# Altium project Horror_esp32.PrjPcb
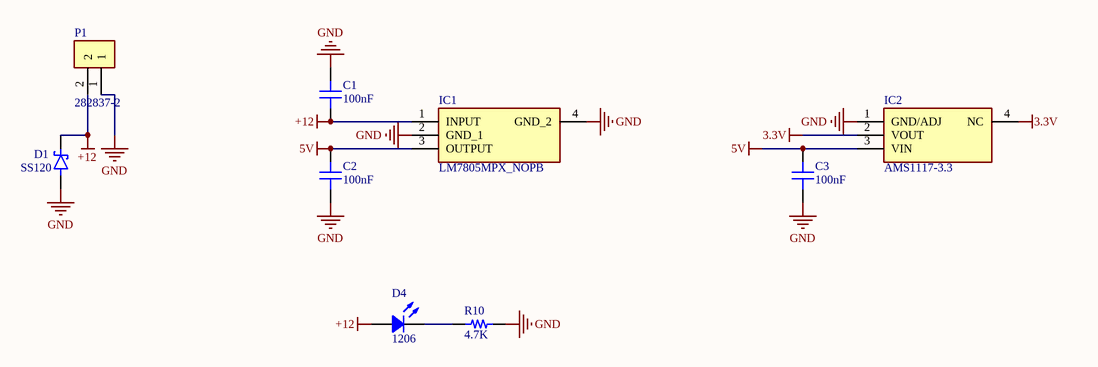
[diagram p0: power.SchDoc]
4 sheets, 58 parts. Net scope: global (net labels, ports and power ports of the same name join across sheets).
Board file: PCB1.PcbDoc
Sheets:
  power.SchDoc
  microprocessor.SchDoc
  connector.SchDoc
  relay.SchDoc

## Sheet power.SchDoc
size A4; SheetNumber: 1; SheetTotal: 4

### Parts
C1  100nF  [CAP 1206_3216 - 0.8MM]
C2  100nF  [CAP 1206_3216 - 0.8MM]
C3  100nF  [CAP 1206_3216 - 0.8MM]
D1  SS120  [DIOM4325X250N]
D4  1206  [LED 1206_3216 YELLOW]
IC1  LM7805MPX_NOPB  [SOT230P700X180-4N]
IC2  AMS1117-3.3  [SOT229P700X180-4N]
P1  282837-2  [TE_282837-2]
R10  4.7K  [RES 1206_3216]

### Nets
3.3V: IC2.2(VOUT) IC2.4(NC)
5V: C2.2 C3.2 IC1.3(OUTPUT) IC2.3(VIN)
+12: C1.1 D1.C(K) D4.1 IC1.1(INPUT) P1.2
GND: C1.2 C2.1 C3.1 D1.A IC1.2(GND_1) IC1.4(GND_2) IC2.1(GND/ADJ) P1.1 R10.1
NetD4_2: D4.2 R10.2

### Library data of the parts
C1-C3 = MM062C102KCZ2A: CAP CER 1000PF 200V X7R 1206; manufacturer: AVX Corporation; Tolerance: ±10%; Part Number: MM062C102KCZ2A; Value: 1000pF; Applications: Medical, Non-Critical; Capacitance: 1000pF; componentlink1description: Datasheet; componentlink1url: http://datasheets.avx.com/AVX-MM.pdf; componentlink2description: DigiKey Link; componentlink2url: http://digikey.com/product-detail/en/avx-corporation/MM062C102KCZ2A/478-10625-1-ND/7344886; Device Package: 1206 (3216 Metric); lastupdated: 2.09.2020 01:04:46; Lifecycle Status: Active; Minimum Order: 1; Mounting Type: Surface Mount, MLCC; Operating Temperature: -55°C ~ 125°C; Package / Case: 1206 (3216 Metric); packaging: TapeAndReel; partid: 18686; Part Status: Active; price: 0.57; series: MM; Size / Dimension: 0.126" L x 0.063" W (3.20mm x 1.60mm); Supplier 1: DigiKey; Supplier Part Number 1: 478-10625-1-ND; Temperature Coefficient: X7R; Thickness (Max): 0.029" (0.74mm); Voltage - Rated: 200V
D1 = SS120: 1A, 200V, Schottky Rectifier; MF: Taiwan Semiconductor; Value: *; SnapEDA_Link: https://www.snapeda.com/parts/SS120/Taiwan+Semiconductor/view-part/?ref=snap; Availability: In Stock; Price: None; Package: SMA-2 Taiwan Semiconductor; Check_prices: https://www.snapeda.com/parts/SS120/Taiwan+Semiconductor/view-part/?ref=eda; MP: SS120
D4 = 25-21UYC/S530-A2/TR8: LED YELLOW CLEAR 2SMD; Manufacturer: Everlight Electronics Co Ltd; Configuration: Standard; Current - Test: 20mA; Lens Color: Colorless; Lens Size: 1.10mm Dia; Lens Style: Round with Domed Top; Millicandela Rating: 45mcd; Viewing Angle: 60°; Voltage - Forward (Vf) (Typ): 2V; Wavelength - Dominant: 589nm; Wavelength - Peak: 591nm; Part Number: 25-21UYC/S530-A2/TR8; Color: Yellow; ComponentLink1Description: Datasheet; ComponentLink1URL: //media.digikey.com/pdf/Data%20Sheets/Everlight%20PDFs/25-21UYC-S530-A2-TR8_V6_11-12-18.pdf; ComponentLink2Description: DigiKey Link; ComponentLink2URL: https://www.digikey.com/en/products/detail/everlight-electronics-co-ltd/25-21UYC-S530-A2-TR8/8535289; Device Package: 1206 (3216 Metric); Height (Max): 1.20mm; LastUpdated: 3.06.2024 20:01:38; Lens Transparency: Clear; Lifecycle Status: Active; Minimum Order: 1; Mounting Type: Surface Mount; Package / Case: 1206 (3216 Metric); Packaging: TapeAndReel; PartId: 2; Part Status: Active; Price: 0.08; Series: -; Size / Dimension: 3.20mm L x 1.60mm W; Supplier 1: DigiKey; Supplier Part Number 1: 1080-1595-1-ND; Supplier Device Package: 2-SMD; Value: Yellow
IC1 = LM7805MPX_NOPB: Integrated Circuit; Manufacturer_Name: Texas Instruments; Manufacturer_Part_Number: LM7805MPX/NOPB; Datasheet Link: https://www.arrow.com/en/products/lm7805mpxnopb/texas-instruments; Height: 1.8mm; Mouser Part Number: 595-LM7805MPX/NOPB; Mouser Price/Stock: https://www.mouser.co.uk/ProductDetail/Texas-Instruments/LM7805MPX-NOPB?qs=gO6GG99qvRCSwIVAoVKHPw%3D%3D; Arrow Part Number: LM7805MPX/NOPB; Arrow Price/Stock: https://www.arrow.com/en/products/lm7805mpxnopb/texas-instruments?utm_currency=USD&region=nac
IC2 = AMS1117-3.3: Integrated Circuit; Manufacturer_Name: Advanced; Datasheet Link: https://datasheet.datasheetarchive.com/originals/distributors/Datasheets-28/DSA-550594.pdf; Height: 1.8mm; Manufacturer_Part_Number: AMS1117-3.3
P1 = 282837-2: Ð Ð°Ð·ÑŠÐµÐ¼Ð½Ñ‹Ðµ ÐºÐ»ÐµÐ¼Ð¼Ð½Ñ‹Ðµ ÐºÐ¾Ð»Ð¾Ð´ÐºÐ¸ Ð Ð¾Ð·ÐµÑ‚ÐºÐ° 2 Ð¿Ð¾Ð»Ð¾Ð¶ÐµÐ½Ð¸Ñ 5,08 Ð¼Ð¼ ÐŸÑ€Ð¸Ð¿Ð¾Ð¹ Ð¿Ñ€ÑÐ¼Ð¾Ð¹ Ñ‡ÐµÑ€ÐµÐ· Ð¾Ñ‚Ð²ÐµÑ€ÑÑ‚Ð¸Ðµ 13,5 Ð / ÐºÐ¾Ð½Ñ‚Ð°ÐºÑ‚; MF: TE Connectivity; SnapEDA_Link: https://www.snapeda.com/parts/282837-2/TE+Connectivity+AMP+Connectors/view-part/?ref=snap; Price: None; Check_prices: https://www.snapeda.com/parts/282837-2/TE+Connectivity+AMP+Connectors/view-part/?ref=eda; Purchase-URL: https://pricing.snapeda.com/search/part/282837-2/?ref=eda; MP: 282837-2; Value: *; Availability: In Stock; Package: None
R10 = CRCW120661K9FKEA: RES SMD 61.9K OHM 1% 1/4W 1206; Manufacturer: Vishay Dale; Power (Watts): 0.25W, 1/4W; Resistance: 61.9 kOhms; Temperature Coefficient: ±100ppm/°C; Value: 61.9 kOhms; Part Number: CRCW120661K9FKEA; ComponentLink1Description: Datasheet; ComponentLink1URL: http://www.vishay.com/docs/20035/dcrcwe3.pdf; ComponentLink2Description: DigiKey Link; ComponentLink2URL: https://www.digikey.com/en/products/detail/vishay-dale/CRCW120661K9FKEA/1176848; Composition: Thick Film; Device Package: 1206 (3216 Metric); Features: Automotive AEC-Q200; Height - Seated (Max): 0.024" (0.60mm); LastUpdated: 9.02.2024 20:54:45; Lifecycle Status: Active; Minimum Order: 1; Number of Terminations: 2; Operating Temperature: -55°C ~ 155°C; Package / Case: 1206 (3216 Metric); Packaging: TapeAndReel; PartId: 26923; Part Status: Active; Price: 0.01; Ratings: AEC-Q200; Series: CRCW; Size / Dimension: 0.126" L x 0.063" W (3.20mm x 1.60mm); Supplier 1: DigiKey; Supplier Part Number 1: 541-61.9KFCT-ND; Supplier Device Package: 1206; Tolerance: ±1%

## Sheet microprocessor.SchDoc
size A4; SheetNumber: 2; SheetTotal: 4
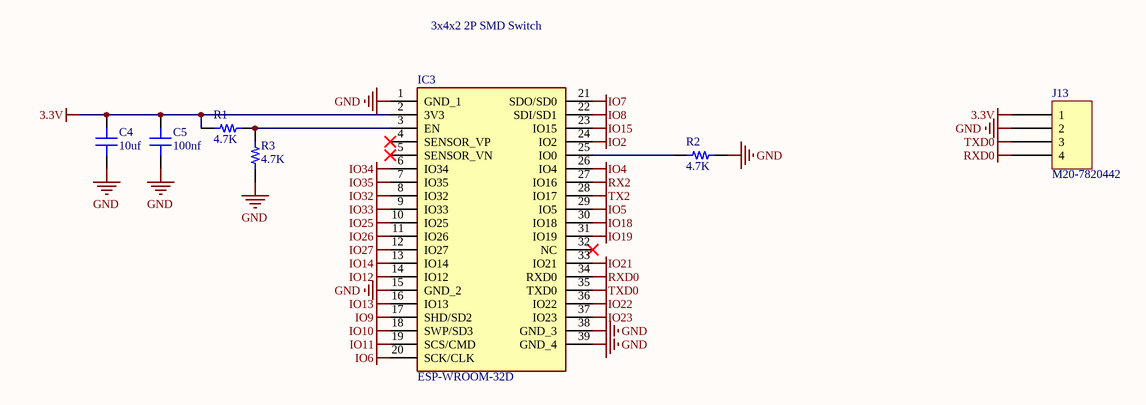
[diagram p1: microprocessor.SchDoc]

### Parts
C4  10uf  [CAP 1206_3216 - 0.8MM]
C5  100nf  [CAP 1206_3216 - 0.8MM]
IC3  ESP-WROOM-32D  [ESPWROOM32D]
J13  M20-7820442  [HARWIN M20-7820445]
R1  4.7K  [RES 1206_3216]
R2  4.7K  [RES 1206_3216]
R3  4.7K  [RES 1206_3216]

### Nets
3.3V: C4.2 C5.2 IC3.2(3V3) J13.1 R1.2
GND: C4.1 C5.1 IC3.1(GND_1) IC3.15(GND_2) IC3.38(GND_3) IC3.39(GND_4) J13.2 R2.1 R3.2
IO2: IC3.24(IO2)
IO4: IC3.26(IO4)
IO5: IC3.29(IO5)
IO6: IC3.20(SCK/CLK)
IO7: IC3.21(SDO/SD0)
IO8: IC3.22(SDI/SD1)
IO9: IC3.17(SHD/SD2)
IO10: IC3.18(SWP/SD3)
IO11: IC3.19(SCS/CMD)
IO12: IC3.14(IO12)
IO13: IC3.16(IO13)
IO14: IC3.13(IO14)
IO15: IC3.23(IO15)
IO18: IC3.30(IO18)
IO19: IC3.31(IO19)
IO21: IC3.33(IO21)
IO22: IC3.36(IO22)
IO23: IC3.37(IO23)
IO25: IC3.10(IO25)
IO26: IC3.11(IO26)
IO27: IC3.12(IO27)
IO32: IC3.8(IO32)
IO33: IC3.9(IO33)
IO34: IC3.6(IO34)
IO35: IC3.7(IO35)
RX2: IC3.27(IO16)
RXD0: IC3.34(RXD0) J13.4
TX2: IC3.28(IO17)
TXD0: IC3.35(TXD0) J13.3
NetIC3_3: IC3.3(EN) R1.1 R3.1
NetIC3_25: IC3.25(IO0) R2.2

Not connected (* = marked no-connect by the designer): IC3 4(SENSOR_VP)* 5(SENSOR_VN)* 32(NC)*

### Notes on the sheet
- 3x4x2 2P SMD Switch

### Library data of the parts
C4 C5 = MM062C102KCZ2A: as C1 on sheet power; Part Number: MM062C102KCZ2A; Value: 1000pF; Applications: Medical, Non-Critical; Capacitance: 1000pF; componentlink1description: Datasheet; componentlink1url: http://datasheets.avx.com/AVX-MM.pdf; componentlink2description: DigiKey Link; componentlink2url: http://digikey.com/product-detail/en/avx-corporation/MM062C102KCZ2A/478-10625-1-ND/7344886; Device Package: 1206 (3216 Metric); lastupdated: 2.09.2020 01:04:46; Lifecycle Status: Active; Minimum Order: 1; Mounting Type: Surface Mount, MLCC; Operating Temperature: -55°C ~ 125°C; Package / Case: 1206 (3216 Metric); packaging: TapeAndReel; partid: 18686; Part Status: Active; price: 0.57; series: MM; Size / Dimension: 0.126" L x 0.063" W (3.20mm x 1.60mm); Supplier 1: DigiKey; Supplier Part Number 1: 478-10625-1-ND; Temperature Coefficient: X7R; Thickness (Max): 0.029" (0.74mm); Voltage - Rated: 200V
IC3 = ESP-WROOM-32D: Integrated Circuit; Manufacturer_Name: Espressif Systems; Datasheet Link: https://componentsearchengine.com/Datasheets/1/ESP-WROOM-32D.pdf; Height: 3.2mm; Manufacturer_Part_Number: ESP-WROOM-32D; Mouser Part Number: 356-ESP-WROOM-32D; Mouser Price/Stock: https://www.mouser.co.uk/ProductDetail/Espressif-Systems/ESP-WROOM-32D?qs=MLItCLRbWsyWVKgdQMcFuQ%3D%3D
J13 = M20-7820442: CONN RCPT 4POS 0.1 GOLD PCB; Manufacturer: Harwin Inc.; Connector Type: Receptacle; Contact Length - Post: 0.118" (3.00mm); Current Rating (Amps): 3A; Mated Stacking Heights: 11.04mm, 12.63mm; Material Flammability Rating: UL94 V-0; Number of Positions: 4; Number of Positions Loaded: All; Pitch - Mating: 0.100" (2.54mm); Style: Board to Board or Cable; Part Number: M20-7820442; ComponentLink1Description: Datasheet; ComponentLink1URL: https://cdn.harwin.com/pdfs/Harwin_PC_Connectors_M20.pdf; ComponentLink2Description: DigiKey Link; ComponentLink2URL: https://www.digikey.com/en/products/detail/harwin-inc/M20-7820442/3727760; Contact Finish - Mating: Gold; Contact Finish - Post: Tin; Contact Finish Thickness - Mating: Flash; Contact Type: Female Socket; Fastening Type: Push-Pull; Insulation Color: Black; Insulation Height: 0.335" (8.51mm); LastUpdated: 21.09.2022 18:57:11; Lifecycle Status: Active; Minimum Order: 1; Mounting Type: Through Hole; Number of Rows: 1; Operating Temperature: -40°C ~ 105°C; Packaging: Tube; Part Status: Active; Price: 0.45; Series: M20; Supplier 1: DigiKey; Supplier Part Number 1: 952-1791-ND; Termination: Solder
R1-R3 = CRCW120661K9FKEA: as R10 on sheet power; Part Number: CRCW120661K9FKEA; ComponentLink1Description: Datasheet; ComponentLink1URL: http://www.vishay.com/docs/20035/dcrcwe3.pdf; ComponentLink2Description: DigiKey Link; ComponentLink2URL: https://www.digikey.com/en/products/detail/vishay-dale/CRCW120661K9FKEA/1176848; Composition: Thick Film; Device Package: 1206 (3216 Metric); Features: Automotive AEC-Q200; Height - Seated (Max): 0.024" (0.60mm); LastUpdated: 9.02.2024 20:54:45; Lifecycle Status: Active; Minimum Order: 1; Number of Terminations: 2; Operating Temperature: -55°C ~ 155°C; Package / Case: 1206 (3216 Metric); Packaging: TapeAndReel; PartId: 26923; Part Status: Active; Price: 0.01; Ratings: AEC-Q200; Series: CRCW; Size / Dimension: 0.126" L x 0.063" W (3.20mm x 1.60mm); Supplier 1: DigiKey; Supplier Part Number 1: 541-61.9KFCT-ND; Supplier Device Package: 1206; Tolerance: ±1%

## Sheet connector.SchDoc
size A4; SheetNumber: 3; SheetTotal: 4
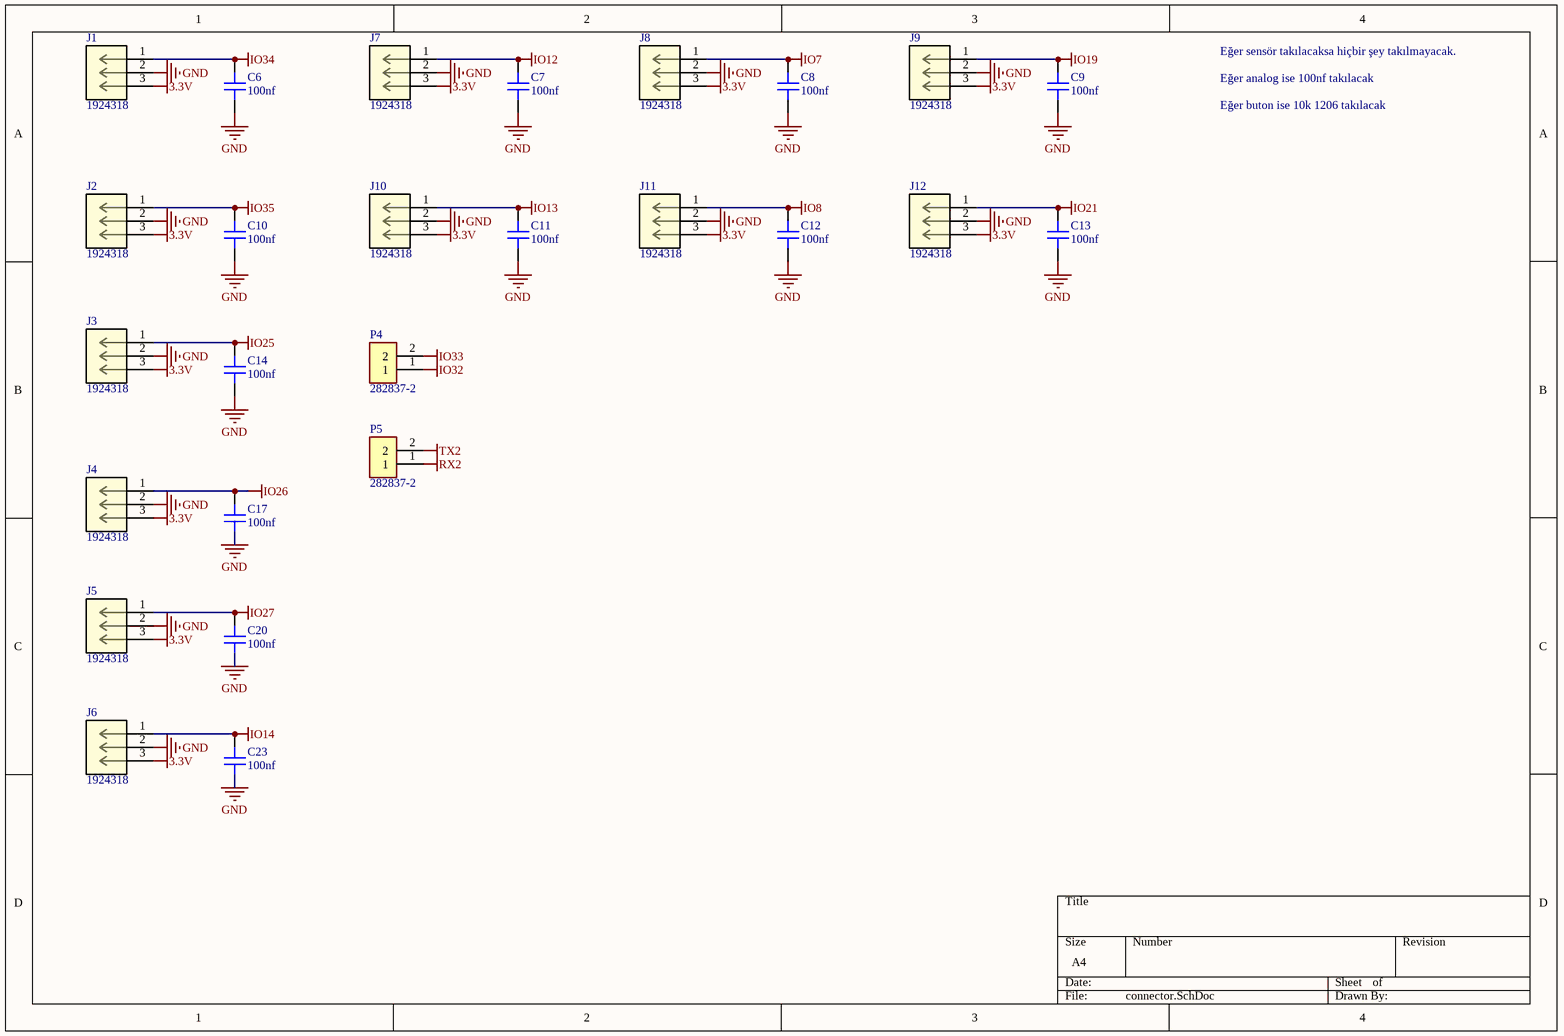
[diagram p2: connector.SchDoc]

### Parts
C6  100nf  [CAP 1206_3216 - 0.8MM]
C7  100nf  [CAP 1206_3216 - 0.8MM]
C8  100nf  [CAP 1206_3216 - 0.8MM]
C9  100nf  [CAP 1206_3216 - 0.8MM]
C10  100nf  [CAP 1206_3216 - 0.8MM]
C11  100nf  [CAP 1206_3216 - 0.8MM]
C12  100nf  [CAP 1206_3216 - 0.8MM]
C13  100nf  [CAP 1206_3216 - 0.8MM]
C14  100nf  [CAP 1206_3216 - 0.8MM]
C17  100nf  [CAP 1206_3216 - 0.8MM]
C20  100nf  [CAP 1206_3216 - 0.8MM]
C23  100nf  [CAP 1206_3216 - 0.8MM]
J1  1924318  [CONN_1924318]
J2  1924318  [CONN_1924318]
J3  1924318  [CONN_1924318]
J4  1924318  [CONN_1924318]
J5  1924318  [CONN_1924318]
J6  1924318  [CONN_1924318]
J7  1924318  [CONN_1924318]
J8  1924318  [CONN_1924318]
J9  1924318  [CONN_1924318]
J10  1924318  [CONN_1924318]
J11  1924318  [CONN_1924318]
J12  1924318  [CONN_1924318]
P4  282837-2  [TE_282837-2]
P5  282837-2  [TE_282837-2]

### Nets
3.3V: J1.3 J2.3 J3.3 J4.3 J5.3 J6.3 J7.3 J8.3 J9.3 J10.3 J11.3 J12.3
GND: C6.1 C7.1 C8.1 C9.1 C10.1 C11.1 C12.1 C13.1 C14.1 C17.1 C20.1 C23.1 J1.2 J2.2 J3.2 J4.2 J5.2 J6.2 J7.2 J8.2 J9.2 J10.2 J11.2 J12.2
IO7: C8.2 J8.1
IO8: C12.2 J11.1
IO12: C7.2 J7.1
IO13: C11.2 J10.1
IO14: C23.2 J6.1
IO19: C9.2 J9.1
IO21: C13.2 J12.1
IO25: C14.2 J3.1
IO26: C17.2 J4.1
IO27: C20.2 J5.1
IO32: P4.1
IO33: P4.2
IO34: C6.2 J1.1
IO35: C10.2 J2.1
RX2: P5.1
TX2: P5.2

### Notes on the sheet
- Eğer sensör takılacaksa hiçbir şey takılmayacak.
- Eğer analog ise 100nf takılacak
- Eğer buton ise 10k 1206 takılacak

### Library data of the parts
C6-C14 C17 C20 C23 = MM062C102KCZ2A: as C1 on sheet power; Part Number: MM062C102KCZ2A; Value: 1000pF; Applications: Medical, Non-Critical; Capacitance: 1000pF; componentlink1description: Datasheet; componentlink1url: http://datasheets.avx.com/AVX-MM.pdf; componentlink2description: DigiKey Link; componentlink2url: http://digikey.com/product-detail/en/avx-corporation/MM062C102KCZ2A/478-10625-1-ND/7344886; Device Package: 1206 (3216 Metric); lastupdated: 2.09.2020 01:04:46; Lifecycle Status: Active; Minimum Order: 1; Mounting Type: Surface Mount, MLCC; Operating Temperature: -55°C ~ 125°C; Package / Case: 1206 (3216 Metric); packaging: TapeAndReel; partid: 18686; Part Status: Active; price: 0.57; series: MM; Size / Dimension: 0.126" L x 0.063" W (3.20mm x 1.60mm); Supplier 1: DigiKey; Supplier Part Number 1: 478-10625-1-ND; Temperature Coefficient: X7R; Thickness (Max): 0.029" (0.74mm); Voltage - Rated: 200V
J1-J12 = 1924318: No Description Available; Mfr_Name: Phoenix Contact; RefDes: RefDes; Type: Type
P4 P5 = 282837-2: as P1 on sheet power; SnapEDA_Link: https://www.snapeda.com/parts/282837-2/TE+Connectivity+AMP+Connectors/view-part/?ref=snap; Price: None; Check_prices: https://www.snapeda.com/parts/282837-2/TE+Connectivity+AMP+Connectors/view-part/?ref=eda; Purchase-URL: https://pricing.snapeda.com/search/part/282837-2/?ref=eda; MP: 282837-2; Value: *; Availability: In Stock; Package: None

## Sheet relay.SchDoc
size A4; SheetNumber: 4; SheetTotal: 4
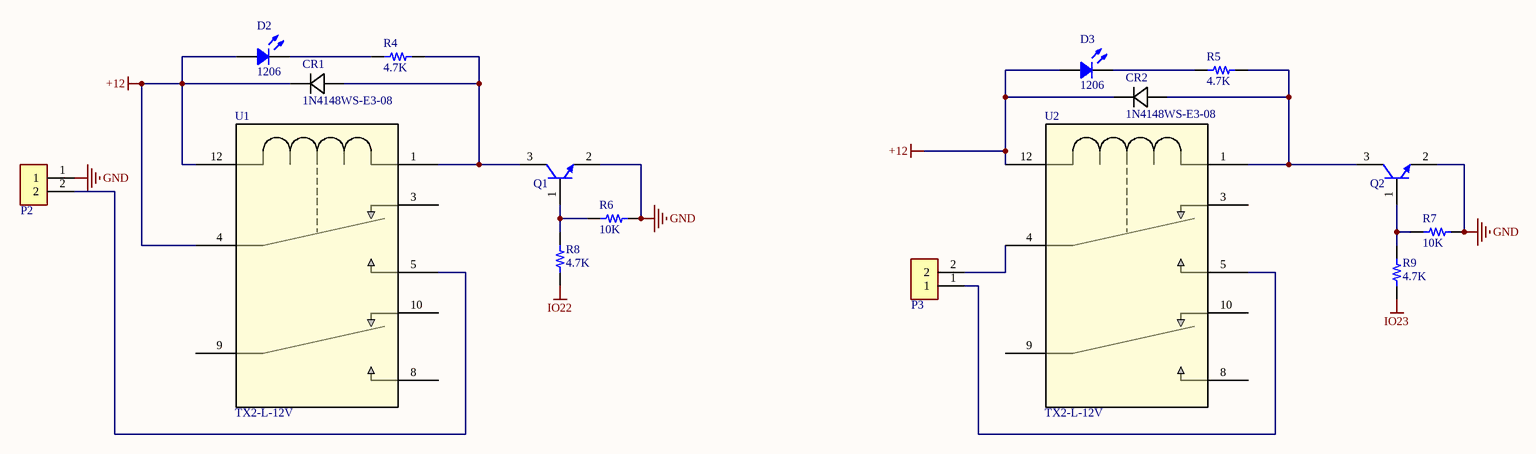
[diagram p3: relay.SchDoc]

### Parts
CR1  1N4148WS-E3-08  [CR_WS-E3-08_VIS]
CR2  1N4148WS-E3-08  [CR_WS-E3-08_VIS]
D2  1206  [LED 1206_3216 YELLOW]
D3  1206  [LED 1206_3216 YELLOW]
P2  282837-2  [TE_282837-2]  (value not drawn)
P3  282837-2  [TE_282837-2]  (value not drawn)
Q1  BC817-25,215  [NEXPERIA SOT-23-3]  (value not drawn)
Q2  BC817-25,215  [NEXPERIA SOT-23-3]  (value not drawn)
R4  4.7K  [RES 1206_3216]
R5  4.7K  [RES 1206_3216]
R6  10K  [RES 1206_3216]
R7  10K  [RES 1206_3216]
R8  4.7K  [RES 1206_3216]
R9  4.7K  [RES 1206_3216]
U1  TX2-L-12V  [RELAY_TX2_PAN]
U2  TX2-L-12V  [RELAY_TX2_PAN]

### Nets
+12: CR1.1 CR2.1 D2.1 D3.1 U1.4 U1.12 U2.12
GND: P2.1 Q1.2(E) Q2.2(E) R6.2 R7.2
IO22: R8.1
IO23: R9.1
NetCR1_2: CR1.2 Q1.3(C) R4.1 U1.1
NetCR2_2: CR2.2 Q2.3(C) R5.1 U2.1
NetD2_2: D2.2 R4.2
NetD3_2: D3.2 R5.2
NetP2_2: P2.2 U1.5
NetP3_1: P3.1 U2.5
NetP3_2: P3.2 U2.4
NetQ1_1: Q1.1(B) R6.1 R8.2
NetQ2_1: Q2.1(B) R7.1 R9.2

Not connected (* = marked no-connect by the designer): U1 3(5) 8(3) 9(6) 10(8); U2 3(5) 8(3) 9(6) 10(8)

### Library data of the parts
CR1 CR2 = 1N4148WS-E3-08: No Description Available; Mfr_Name: Vishay
D2 D3 = 25-21UYC/S530-A2/TR8: as D4 on sheet power; Part Number: 25-21UYC/S530-A2/TR8; Color: Yellow; ComponentLink1Description: Datasheet; ComponentLink1URL: //media.digikey.com/pdf/Data%20Sheets/Everlight%20PDFs/25-21UYC-S530-A2-TR8_V6_11-12-18.pdf; ComponentLink2Description: DigiKey Link; ComponentLink2URL: https://www.digikey.com/en/products/detail/everlight-electronics-co-ltd/25-21UYC-S530-A2-TR8/8535289; Device Package: 1206 (3216 Metric); Height (Max): 1.20mm; LastUpdated: 3.06.2024 20:01:38; Lens Transparency: Clear; Lifecycle Status: Active; Minimum Order: 1; Mounting Type: Surface Mount; Package / Case: 1206 (3216 Metric); Packaging: TapeAndReel; PartId: 2; Part Status: Active; Price: 0.08; Series: -; Size / Dimension: 3.20mm L x 1.60mm W; Supplier 1: DigiKey; Supplier Part Number 1: 1080-1595-1-ND; Supplier Device Package: 2-SMD; Value: Yellow
P2 P3 = 282837-2: as P1 on sheet power; SnapEDA_Link: https://www.snapeda.com/parts/282837-2/TE+Connectivity+AMP+Connectors/view-part/?ref=snap; Price: None; Check_prices: https://www.snapeda.com/parts/282837-2/TE+Connectivity+AMP+Connectors/view-part/?ref=eda; Purchase-URL: https://pricing.snapeda.com/search/part/282837-2/?ref=eda; MP: 282837-2; Value: *; Availability: In Stock; Package: None
Q1 Q2 = BC817-25,215: TRANS NPN 45V 0.5A TO236AB; Manufacturer: Nexperia USA Inc.; Current - Collector Cutoff (Max): 100nA (ICBO); Current - Collector (Ic) (Max): 500 mA; DC Current Gain (hFE) (Min) @ Ic, Vce: 160 @ 100mA, 1V; Frequency - Transition: 100MHz; Power - Max: 250 mW; Vce Saturation (Max) @ Ib, Ic: 700mV @ 50mA, 500mA; Part Number: BC817-25,215; ComponentLink1Description: Datasheet; ComponentLink1URL: https://assets.nexperia.com/documents/data-sheet/BC817_SER.pdf; ComponentLink2Description: DigiKey Link; ComponentLink2URL: https://www.digikey.com/en/products/detail/nexperia-usa-inc/BC817-25-215/763234; LastUpdated: 3.06.2024 20:24:20; Lifecycle Status: Active; Minimum Order: 1; Mounting Type: Surface Mount; Operating Temperature: 150°C (TJ); Package / Case: TO-236-3, SC-59, SOT-23-3; Packaging: TapeAndReel; PartId: 319; Part Status: Active; Price: 0.02; Series: -; Supplier 1: DigiKey; Supplier Part Number 1: 1727-2918-1-ND; Supplier Device Package: TO-236AB; Transistor Type: NPN; Voltage - Collector Emitter Breakdown (Max): 45 V
R4-R9 = CRCW120661K9FKEA: as R10 on sheet power; Part Number: CRCW120661K9FKEA; ComponentLink1Description: Datasheet; ComponentLink1URL: http://www.vishay.com/docs/20035/dcrcwe3.pdf; ComponentLink2Description: DigiKey Link; ComponentLink2URL: https://www.digikey.com/en/products/detail/vishay-dale/CRCW120661K9FKEA/1176848; Composition: Thick Film; Device Package: 1206 (3216 Metric); Features: Automotive AEC-Q200; Height - Seated (Max): 0.024" (0.60mm); LastUpdated: 9.02.2024 20:54:45; Lifecycle Status: Active; Minimum Order: 1; Number of Terminations: 2; Operating Temperature: -55°C ~ 155°C; Package / Case: 1206 (3216 Metric); Packaging: TapeAndReel; PartId: 26923; Part Status: Active; Price: 0.01; Ratings: AEC-Q200; Series: CRCW; Size / Dimension: 0.126" L x 0.063" W (3.20mm x 1.60mm); Supplier 1: DigiKey; Supplier Part Number 1: 541-61.9KFCT-ND; Supplier Device Package: 1206; Tolerance: ±1%
U1 U2 = TX2-L-12V: No Description Available; Mfr_Name: Panasonic; Digi-Key_Part_Number_1: TX2-L-12V-ND; RefDes: RefDes; Type: Type

## Nets that join several sheets
3.3V: power (IC2.2 IC2.4), microprocessor (5 pins), connector (12 pins)
+12: power (5 pins), relay (7 pins)
GND: power (9 pins), microprocessor (9 pins), connector (24 pins), relay (5 pins)
IO7: microprocessor (IC3.21), connector (C8.2 J8.1)
IO8: microprocessor (IC3.22), connector (C12.2 J11.1)
IO12: microprocessor (IC3.14), connector (C7.2 J7.1)
IO13: microprocessor (IC3.16), connector (C11.2 J10.1)
IO14: microprocessor (IC3.13), connector (C23.2 J6.1)
IO19: microprocessor (IC3.31), connector (C9.2 J9.1)
IO21: microprocessor (IC3.33), connector (C13.2 J12.1)
IO22: microprocessor (IC3.36), relay (R8.1)
IO23: microprocessor (IC3.37), relay (R9.1)
IO25: microprocessor (IC3.10), connector (C14.2 J3.1)
IO26: microprocessor (IC3.11), connector (C17.2 J4.1)
IO27: microprocessor (IC3.12), connector (C20.2 J5.1)
IO32: microprocessor (IC3.8), connector (P4.1)
IO33: microprocessor (IC3.9), connector (P4.2)
IO34: microprocessor (IC3.6), connector (C6.2 J1.1)
IO35: microprocessor (IC3.7), connector (C10.2 J2.1)
RX2: microprocessor (IC3.27), connector (P5.1)
TX2: microprocessor (IC3.28), connector (P5.2)